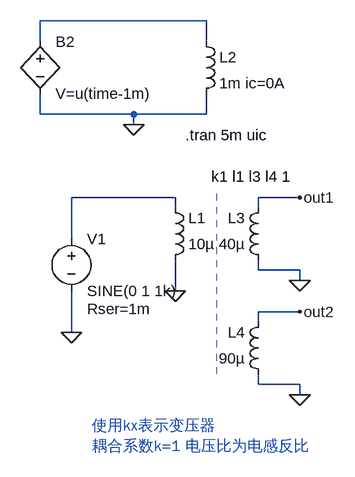
[diagram p0: schematic Draft3.asc]
Draft3.asc, the LTspice schematic file:
Version 4.1
SHEET 1 880 876
WIRE 352 208 96 208
WIRE 96 240 96 208
WIRE 352 240 352 208
WIRE 96 352 96 320
WIRE 240 352 96 352
WIRE 352 352 352 320
WIRE 352 352 240 352
WIRE 240 368 240 352
WIRE 304 480 144 480
WIRE 496 480 432 480
WIRE 304 496 304 480
WIRE 432 496 432 480
WIRE 144 544 144 480
WIRE 432 592 432 576
WIRE 496 592 432 592
WIRE 496 608 496 592
WIRE 304 624 304 576
WIRE 496 656 432 656
WIRE 432 672 432 656
WIRE 144 688 144 624
WIRE 432 768 432 752
WIRE 496 768 432 768
WIRE 496 784 496 768
FLAG 240 368 0
FLAG 144 688 0
FLAG 496 784 0
FLAG 496 608 0
FLAG 304 624 0
FLAG 496 480 out1
FLAG 496 656 out2
SYMBOL bv 96 224 R0
SYMATTR InstName B2
SYMATTR Value V=u(time-1m)
SYMBOL ind 336 224 R0
SYMATTR InstName L2
SYMATTR Value 1m ic=0A
SYMBOL ind 288 592 M180
WINDOW 0 36 80 Left 2
WINDOW 3 36 40 Left 2
SYMATTR InstName L1
SYMATTR Value 10µ
SYMATTR Type ind
SYMBOL ind 448 592 R180
WINDOW 0 36 80 Left 2
WINDOW 3 36 40 Left 2
SYMATTR InstName L3
SYMATTR Value 40µ
SYMATTR Type ind
SYMBOL ind 448 768 R180
WINDOW 0 36 80 Left 2
WINDOW 3 36 40 Left 2
SYMATTR InstName L4
SYMATTR Value 90µ
SYMATTR Type ind
SYMBOL voltage 144 528 R0
WINDOW 123 0 0 Left 0
WINDOW 39 24 124 Left 2
SYMATTR InstName V1
SYMATTR Value SINE(0 1 1k)
SYMATTR SpiceLine Rser=1m
TEXT 320 384 Left 2 !.tran 5m uic
TEXT 360 448 Left 2 !k1 l1 l3 l4 1
TEXT 176 832 Left 2 ;使用kx表示变压器 \n耦合系数k=1 电压比为电感反比
LINE Normal 368 752 368 464 2

The netlist it stands for:
* Draft3.asc
B2 N001 0 V=u(time-1m)
L2 N001 0 1m ic=0A
L1 0 N002 10µ
L3 0 out1 40µ
L4 0 out2 90µ
V1 N002 0 SINE(0 1 1k) Rser=1m
.tran 5m uic
k1 l1 l3 l4 1
* 使用kx表示变压器
* 耦合系数k=1 电压比为电感反比
.backanno
.end

* Results of the author's LTspice run, read from the files saved beside the schematic
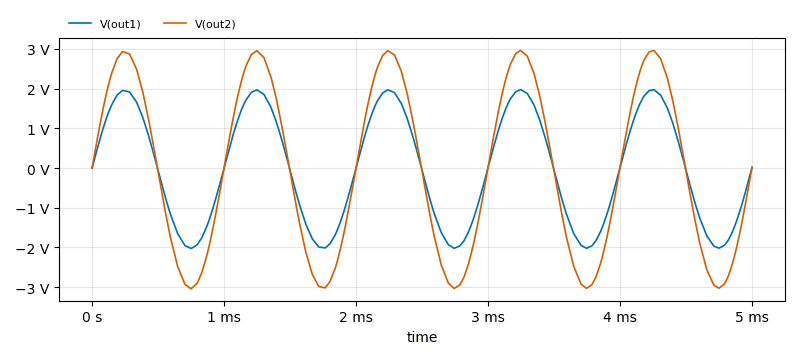
[diagram p1: Transient Analysis of Draft3.asc, plotted from the saved traces]
* Transient Analysis, 1 run:
*   V(out1): min -2.029 V, max 1.977 V, average -24.99 mV, rms 1.409 V, last 12.52 mV
*   V(out2): min -3.043 V, max 2.965 V, average -37.49 mV, rms 2.114 V, last 18.78 mV